# Altium schematic sheet IN14二灯.SchDoc
size A2; SheetNumber: 1; SheetTotal: 1
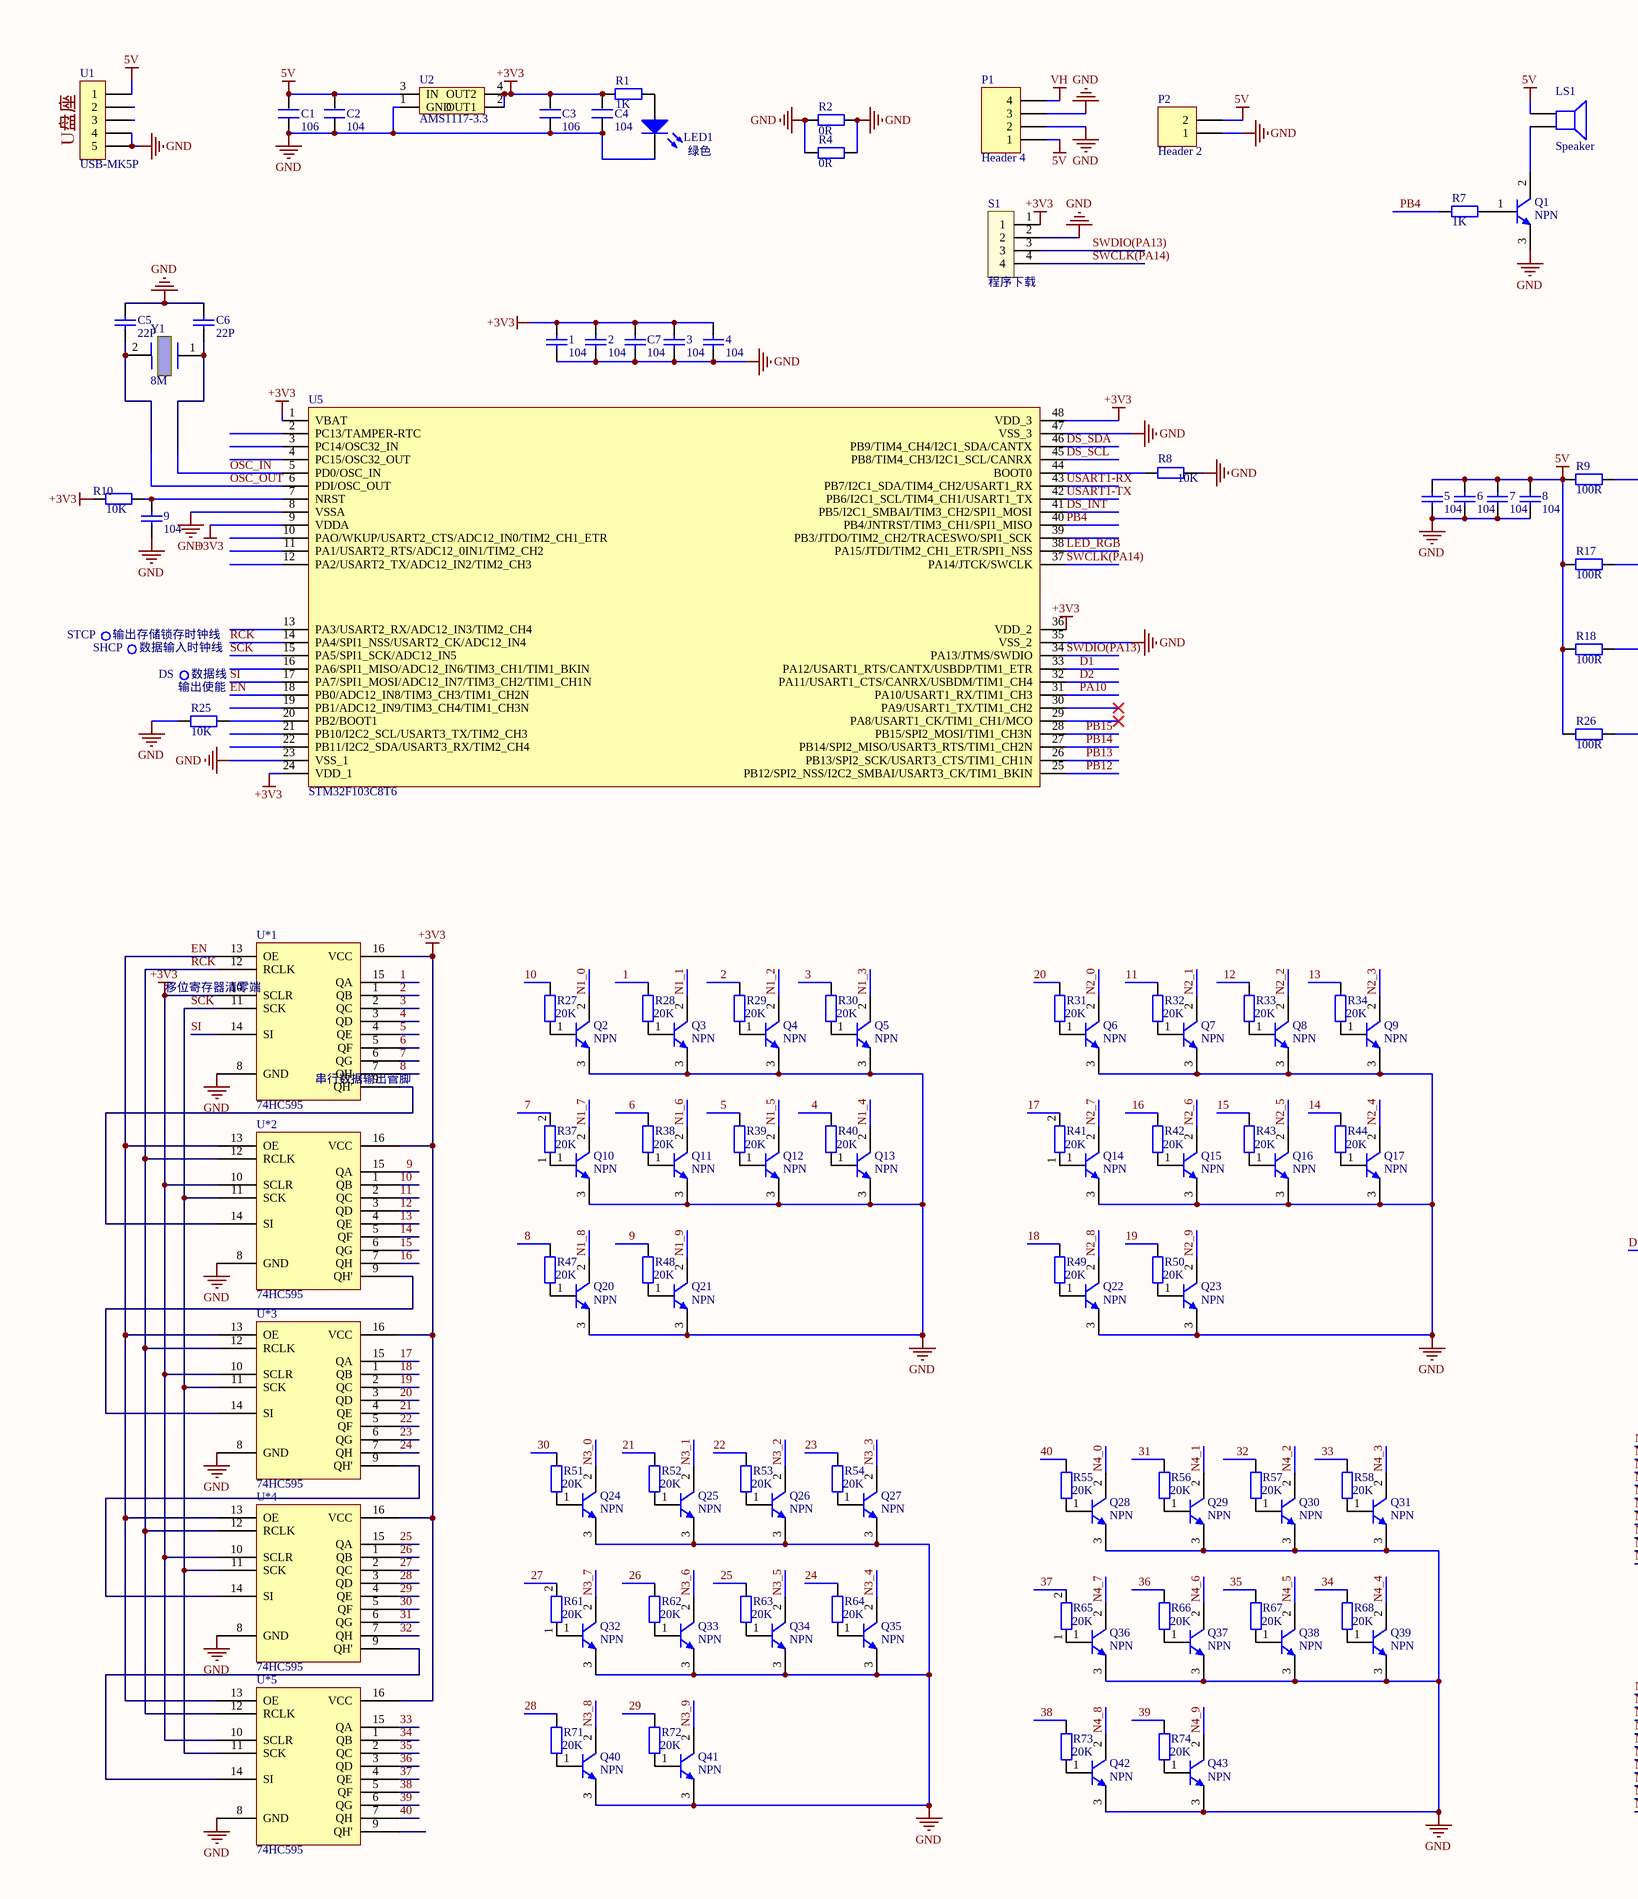
[diagram p0: IN14二灯.SchDoc, left]
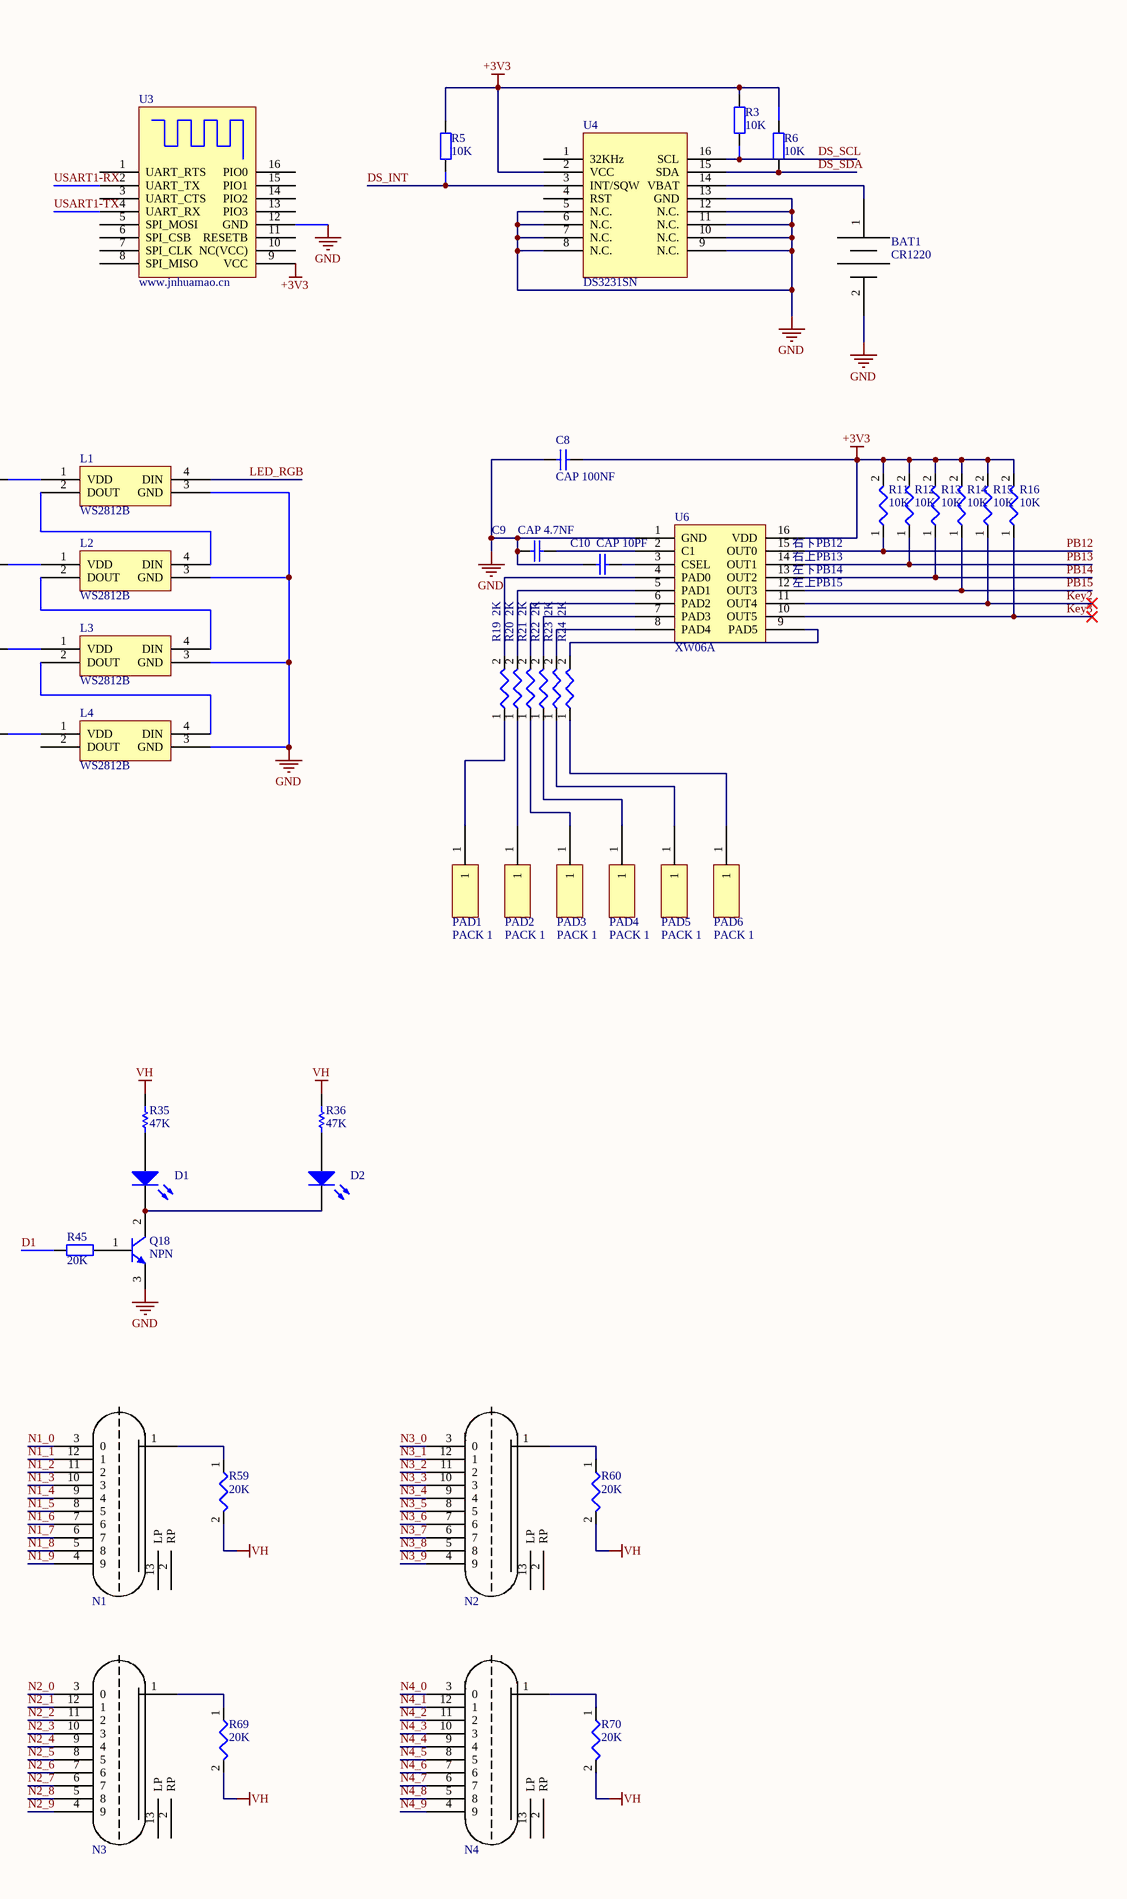
[diagram p1: IN14二灯.SchDoc, right]

## Parts
1  104  [0603C]
2  104  [0603C]
3  104  [0603C]
4  104  [0603C]
5  104  [0603C]
6  104  [0603C]
7  104  [0603C]
8  104  [0603C]
9  104  [0603C]
BAT1  CR1220  [1220]
C1  106  [0805C]
C2  104  [0603C]
C3  106  [0805C]
C4  104  [0603C]
C5  22P  [0603C]
C6  22P  [0603C]
C7  104  [0603C]
C8  CAP 100NF  [0603C]
C9  CAP 4.7NF  [0603C]
C10  CAP 10PF  [0603C]
D1  LED0  [R38]  (value not drawn)
D2  LED0  [R38]  (value not drawn)
L1  WS2812B  [WS2812B]
L2  WS2812B  [WS2812B]
L3  WS2812B  [WS2812B]
L4  WS2812B  [WS2812B]
LED1  绿色  [LED_0805]
LS1  Speaker  [蜂鸣器9*9*5]
N1  IN_14  [IN14]  (value not drawn)
N2  IN_14  [IN14]  (value not drawn)
N3  IN_14  [IN14]  (value not drawn)
N4  IN_14  [IN14]  (value not drawn)
P1  Header 4  [XH2.54 4p贴片]
P2  Header 2  [XH2.54-2P]
PAD1  PACK 1  [PACK 1]
PAD2  PACK 1  [PACK 1]
PAD3  PACK 1  [PACK 1]
PAD4  PACK 1  [PACK 1]
PAD5  PACK 1  [PACK 1]
PAD6  PACK 1  [PACK 1]
Q1  NPN  [LC-SOT-23(SOT-23-3)]
Q2  NPN  [LC-SOT-23(SOT-23-3)]
Q3  NPN  [LC-SOT-23(SOT-23-3)]
Q4  NPN  [LC-SOT-23(SOT-23-3)]
Q5  NPN  [LC-SOT-23(SOT-23-3)]
Q6  NPN  [LC-SOT-23(SOT-23-3)]
Q7  NPN  [LC-SOT-23(SOT-23-3)]
Q8  NPN  [LC-SOT-23(SOT-23-3)]
Q9  NPN  [LC-SOT-23(SOT-23-3)]
Q10  NPN  [LC-SOT-23(SOT-23-3)]
Q11  NPN  [LC-SOT-23(SOT-23-3)]
Q12  NPN  [LC-SOT-23(SOT-23-3)]
Q13  NPN  [LC-SOT-23(SOT-23-3)]
Q14  NPN  [LC-SOT-23(SOT-23-3)]
Q15  NPN  [LC-SOT-23(SOT-23-3)]
Q16  NPN  [LC-SOT-23(SOT-23-3)]
Q17  NPN  [LC-SOT-23(SOT-23-3)]
Q18  NPN  [LC-SOT-23(SOT-23-3)]
Q20  NPN  [LC-SOT-23(SOT-23-3)]
Q21  NPN  [LC-SOT-23(SOT-23-3)]
Q22  NPN  [LC-SOT-23(SOT-23-3)]
Q23  NPN  [LC-SOT-23(SOT-23-3)]
Q24  NPN  [LC-SOT-23(SOT-23-3)]
Q25  NPN  [LC-SOT-23(SOT-23-3)]
Q26  NPN  [LC-SOT-23(SOT-23-3)]
Q27  NPN  [LC-SOT-23(SOT-23-3)]
Q28  NPN  [LC-SOT-23(SOT-23-3)]
Q29  NPN  [LC-SOT-23(SOT-23-3)]
Q30  NPN  [LC-SOT-23(SOT-23-3)]
Q31  NPN  [LC-SOT-23(SOT-23-3)]
Q32  NPN  [LC-SOT-23(SOT-23-3)]
Q33  NPN  [LC-SOT-23(SOT-23-3)]
Q34  NPN  [LC-SOT-23(SOT-23-3)]
Q35  NPN  [LC-SOT-23(SOT-23-3)]
Q36  NPN  [LC-SOT-23(SOT-23-3)]
Q37  NPN  [LC-SOT-23(SOT-23-3)]
Q38  NPN  [LC-SOT-23(SOT-23-3)]
Q39  NPN  [LC-SOT-23(SOT-23-3)]
Q40  NPN  [LC-SOT-23(SOT-23-3)]
Q41  NPN  [LC-SOT-23(SOT-23-3)]
Q42  NPN  [LC-SOT-23(SOT-23-3)]
Q43  NPN  [LC-SOT-23(SOT-23-3)]
R1  1K  [0603R]
R2  0R  [0603R]
R3  10K  [0603R]
R4  0R  [0603R]
R5  10K  [0603R]
R6  10K  [0603R]
R7  1K  [0603R]
R8  10K  [0603R]
R9  100R  [0603R]
R10  10K  [0603R]
R11  10K  [0603R]
R12  10K  [0603R]
R13  10K  [0603R]
R14  10K  [0603R]
R15  10K  [0603R]
R16  10K  [0603R]
R17  100R  [0603R]
R18  100R  [0603R]
R19  2K  [0603R]
R20  2K  [0603R]
R21  2K  [0603R]
R22  2K  [0603R]
R23  2K  [0603R]
R24  2K  [0603R]
R25  10K  [0603R]
R26  100R  [0603R]
R27  20K  [0603R]
R28  20K  [0603R]
R29  20K  [0603R]
R30  20K  [0603R]
R31  20K  [0603R]
R32  20K  [0603R]
R33  20K  [0603R]
R34  20K  [0603R]
R35  value 47K  [0805C]  (hidden comment: Res1)
R36  value 47K  [0805C]  (hidden comment: Res1)
R37  20K  [0603R]
R38  20K  [0603R]
R39  20K  [0603R]
R40  20K  [0603R]
R41  20K  [0603R]
R42  20K  [0603R]
R43  20K  [0603R]
R44  20K  [0603R]
R45  20K  [0603R]
R47  20K  [0603R]
R48  20K  [0603R]
R49  20K  [0603R]
R50  20K  [0603R]
R51  20K  [0603R]
R52  20K  [0603R]
R53  20K  [0603R]
R54  20K  [0603R]
R55  20K  [0603R]
R56  20K  [0603R]
R57  20K  [0603R]
R58  20K  [0603R]
R59  20K  [0805C]
R60  20K  [0805C]
R61  20K  [0603R]
R62  20K  [0603R]
R63  20K  [0603R]
R64  20K  [0603R]
R65  20K  [0603R]
R66  20K  [0603R]
R67  20K  [0603R]
R68  20K  [0603R]
R69  20K  [0805C]
R70  20K  [0805C]
R71  20K  [0603R]
R72  20K  [0603R]
R73  20K  [0603R]
R74  20K  [0603R]
S1  程序下载  [HDR1X4]
U1  USB-MK5P  [USB-MK5P]
U2  AMS1117-3.3  [LC-SOT-223 (1117)]
U3  www.jnhuamao.cn  [HM-05_06_07_11]
U4  DS3231SN  [LC-SOP-16_300mil]
U5  STM32F103C8T6  [LQFP-48_M]
U6  XW06A  [SO-16_L]
U*1  74HC595  [SOP16_M]
U*2  74HC595  [SOP16_M]
U*3  74HC595  [SOP16_M]
U*4  74HC595  [SOP16_M]
U*5  74HC595  [SOP16_M]
Y1  8M  [Y-XTAL T]

## Nets
5V: 5.2 6.2 7.2 8.2 C1.2 C2.2 LS1.1 P1.1 P2.2 R9.1 R17.1 R18.1 R26.1 U1.1 U2.3(IN)
+3V3: 1.2 2.2 3.2 4.2 C3.2 C4.2 C7.1 C8.2 R1.1 R3.2 R5.2 R6.2 R10.2 R11.2 R12.2 R13.2 R14.2 R15.2 R16.2 S1.1 U2.2(OUT1) U2.4(OUT2) U3.9(VCC) U4.2(VCC) U5.1(VBAT) U5.9(VDDA) U5.24(VDD_1) U5.36(VDD_2) U5.48(VDD_3) U6.16(VDD) U*1.10(SCLR) U*1.16(VCC) U*2.10(SCLR) U*2.16(VCC) U*3.10(SCLR) U*3.16(VCC) U*4.10(SCLR) U*4.16(VCC) U*5.10(SCLR) U*5.16(VCC)
GND: 1.1 2.1 3.1 4.1 5.1 6.1 7.1 8.1 9.2 BAT1.2 C1.1 C2.1 C3.1 C4.1 C5.2 C6.2 C7.2 C8.1 C9.1 C10.1 L1.3(GND) L2.3(GND) L3.3(GND) L4.3(GND) LED1.2(K) P1.2 P1.3 P2.1 Q1.3(C) Q2.3(C) Q3.3(C) Q4.3(C) Q5.3(C) Q6.3(C) Q7.3(C) Q8.3(C) Q9.3(C) Q10.3(C) Q11.3(C) Q12.3(C) Q13.3(C) Q14.3(C) Q15.3(C) Q16.3(C) Q17.3(C) Q18.3(C) Q20.3(C) Q21.3(C) Q22.3(C) Q23.3(C) Q24.3(C) Q25.3(C) Q26.3(C) Q27.3(C) Q28.3(C) Q29.3(C) Q30.3(C) Q31.3(C) Q32.3(C) Q33.3(C) Q34.3(C) Q35.3(C) Q36.3(C) Q37.3(C) Q38.3(C) Q39.3(C) Q40.3(C) Q41.3(C) Q42.3(C) Q43.3(C) R2.1 R2.2 R4.1 R4.2 R8.1 R25.2 S1.2 U1.4 U1.5 U2.1(GND) U3.12(GND) U4.5(N.C.) U4.6(N.C.) U4.7(N.C.) U4.8(N.C.) U4.9(N.C.) U4.10(N.C.) U4.11(N.C.) U4.12(N.C.) U4.13(GND) U5.8(VSSA) U5.23(VSS_1) U5.35(VSS_2) U5.47(VSS_3) U6.1(GND) U*1.8(GND) U*2.8(GND) U*3.8(GND) U*4.8(GND) U*5.8(GND)
VH: P1.4 R35.1 R36.1 R59.2 R60.2 R69.2 R70.2
1: R28.2 U*1.15(QA)
2: R29.2 U*1.1(QB)
3: R30.2 U*1.2(QC)
4: R40.2 U*1.3(QD)
5: R39.2 U*1.4(QE)
6: R38.2 U*1.5(QF)
7: R37.2 U*1.6(QG)
8: R47.2 U*1.7(QH)
9: R48.2 U*2.15(QA)
10: R27.2 U*2.1(QB)
11: R32.2 U*2.2(QC)
12: R33.2 U*2.3(QD)
13: R34.2 U*2.4(QE)
14: R44.2 U*2.5(QF)
15: R43.2 U*2.6(QG)
16: R42.2 U*2.7(QH)
17: R41.2 U*3.15(QA)
18: R49.2 U*3.1(QB)
19: R50.2 U*3.2(QC)
20: R31.2 U*3.3(QD)
21: R52.2 U*3.4(QE)
22: R53.2 U*3.5(QF)
23: R54.2 U*3.6(QG)
24: R64.2 U*3.7(QH)
25: R63.2 U*4.15(QA)
26: R62.2 U*4.1(QB)
27: R61.2 U*4.2(QC)
28: R71.2 U*4.3(QD)
29: R72.2 U*4.4(QE)
30: R51.2 U*4.5(QF)
31: R56.2 U*4.6(QG)
32: R57.2 U*4.7(QH)
33: R58.2 U*5.15(QA)
34: R68.2 U*5.1(QB)
35: R67.2 U*5.2(QC)
36: R66.2 U*5.3(QD)
37: R65.2 U*5.4(QE)
38: R73.2 U*5.5(QF)
39: R74.2 U*5.6(QG)
40: R55.2 U*5.7(QH)
D1: R45.1 U5.33(PA12/USART1_RTS/CANTX/USBDP/TIM1_ETR)
D2: U5.32(PA11/USART1_CTS/CANRX/USBDM/TIM1_CH4)
DS_INT: R5.1 U4.3(INT/SQW) U5.41(PB5/I2C1_SMBAI/TIM3_CH2/SPI1_MOSI)
DS_SCL: R3.1 U4.16(SCL) U5.45(PB8/TIM4_CH3/I2C1_SCL/CANRX)
DS_SDA: R6.1 U4.15(SDA) U5.46(PB9/TIM4_CH4/I2C1_SDA/CANTX)
EN: U5.18(PB0/ADC12_IN8/TIM3_CH3/TIM1_CH2N) U*1.13(OE) U*2.13(OE) U*3.13(OE) U*4.13(OE) U*5.13(OE)
Key2: R15.1 U6.11(OUT4)
Key3: R16.1 U6.10(OUT5)
LED_RGB: L1.4(DIN) U5.38(PA15/JTDI/TIM2_CH1_ETR/SPI1_NSS)
N1_0: N1.3(0) Q2.2(B)
N1_1: N1.12(1) Q3.2(B)
N1_2: N1.11(2) Q4.2(B)
N1_3: N1.10(3) Q5.2(B)
N1_4: N1.9(4) Q13.2(B)
N1_5: N1.8(5) Q12.2(B)
N1_6: N1.7(6) Q11.2(B)
N1_7: N1.6(7) Q10.2(B)
N1_8: N1.5(8) Q20.2(B)
N1_9: N1.4(9) Q21.2(B)
N2_0: N3.3(0) Q6.2(B)
N2_1: N3.12(1) Q7.2(B)
N2_2: N3.11(2) Q8.2(B)
N2_3: N3.10(3) Q9.2(B)
N2_4: N3.9(4) Q17.2(B)
N2_5: N3.8(5) Q16.2(B)
N2_6: N3.7(6) Q15.2(B)
N2_7: N3.6(7) Q14.2(B)
N2_8: N3.5(8) Q22.2(B)
N2_9: N3.4(9) Q23.2(B)
N3_0: N2.3(0) Q24.2(B)
N3_1: N2.12(1) Q25.2(B)
N3_2: N2.11(2) Q26.2(B)
N3_3: N2.10(3) Q27.2(B)
N3_4: N2.9(4) Q35.2(B)
N3_5: N2.8(5) Q34.2(B)
N3_6: N2.7(6) Q33.2(B)
N3_7: N2.6(7) Q32.2(B)
N3_8: N2.5(8) Q40.2(B)
N3_9: N2.4(9) Q41.2(B)
N4_0: N4.3(0) Q28.2(B)
N4_1: N4.12(1) Q29.2(B)
N4_2: N4.11(2) Q30.2(B)
N4_3: N4.10(3) Q31.2(B)
N4_4: N4.9(4) Q39.2(B)
N4_5: N4.8(5) Q38.2(B)
N4_6: N4.7(6) Q37.2(B)
N4_7: N4.6(7) Q36.2(B)
N4_8: N4.5(8) Q42.2(B)
N4_9: N4.4(9) Q43.2(B)
OSC_IN: C6.1 U5.5(PD0/OSC_IN) Y1.1
OSC_OUT: C5.1 U5.6(PDI/OSC_OUT) Y1.2
PA10: U5.31(PA10/USART1_RX/TIM1_CH3)
PB4: R7.2 U5.40(PB4/JNTRST/TIM3_CH1/SPI1_MISO)
PB12: R11.1 U5.25(PB12/SPI2_NSS/I2C2_SMBAI/USART3_CK/TIM1_BKIN) U6.15(OUT0)
PB13: R12.1 U5.26(PB13/SPI2_SCK/USART3_CTS/TIM1_CH1N) U6.14(OUT1)
PB14: R13.1 U5.27(PB14/SPI2_MISO/USART3_RTS/TIM1_CH2N) U6.13(OUT2)
PB15: R14.1 U5.28(PB15/SPI2_MOSI/TIM1_CH3N) U6.12(OUT3)
RCK: U5.14(PA4/SPI1_NSS/USART2_CK/ADC12_IN4) U*1.12(RCLK) U*2.12(RCLK) U*3.12(RCLK) U*4.12(RCLK) U*5.12(RCLK)
SCK: U5.15(PA5/SPI1_SCK/ADC12_IN5) U*1.11(SCK) U*2.11(SCK) U*3.11(SCK) U*4.11(SCK) U*5.11(SCK)
SI: U5.17(PA7/SPI1_MOSI/ADC12_IN7/TIM3_CH2/TIM1_CH1N) U*1.14(SI)
SWCLK(PA14): S1.4 U5.37(PA14/JTCK/SWCLK)
SWDIO(PA13): S1.3 U5.34(PA13/JTMS/SWDIO)
USART1-RX: U3.2(UART_TX) U5.43(PB7/I2C1_SDA/TIM4_CH2/USART1_RX)
USART1-TX: U3.4(UART_RX) U5.42(PB6/I2C1_SCL/TIM4_CH1/USART1_TX)
Net9_1: 9.1 R10.1 U5.7(NRST)
NetBAT1_1: BAT1.1 U4.14(VBAT)
NetC9_2: C9.2 U6.2(C1)
NetC10_2: C10.2 U6.3(CSEL)
NetD1_1: D1.1(A) R35.2
NetD1_2: D1.2(K) D2.2(K) Q18.2(B)
NetD2_1: D2.1(A) R36.2
NetL1_1: L1.1(VDD) R9.2
NetL1_2: L1.2(DOUT) L2.4(DIN)
NetL2_1: L2.1(VDD) R17.2
NetL2_2: L2.2(DOUT) L3.4(DIN)
NetL3_1: L3.1(VDD) R18.2
NetL3_2: L3.2(DOUT) L4.4(DIN)
NetL4_1: L4.1(VDD) R26.2
NetLED1_1: LED1.1(A) R1.2
NetLS1_2: LS1.2 Q1.2(B)
NetN1_1: N1.1(VCC) R59.1
NetN2_1: N2.1(VCC) R60.1
NetN3_1: N3.1(VCC) R69.1
NetN4_1: N4.1(VCC) R70.1
NetPAD1_1: PAD1.1 R19.1
NetPAD2_1: PAD2.1 R20.1
NetPAD3_1: PAD3.1 R21.1
NetPAD4_1: PAD4.1 R22.1
NetPAD5_1: PAD5.1 R23.1
NetPAD6_1: PAD6.1 R24.1
NetQ1_1: Q1.1(E) R7.1
NetQ2_1: Q2.1(E) R27.1
NetQ3_1: Q3.1(E) R28.1
NetQ4_1: Q4.1(E) R29.1
NetQ5_1: Q5.1(E) R30.1
NetQ6_1: Q6.1(E) R31.1
NetQ7_1: Q7.1(E) R32.1
NetQ8_1: Q8.1(E) R33.1
NetQ9_1: Q9.1(E) R34.1
NetQ10_1: Q10.1(E) R37.1
NetQ11_1: Q11.1(E) R38.1
NetQ12_1: Q12.1(E) R39.1
NetQ13_1: Q13.1(E) R40.1
NetQ14_1: Q14.1(E) R41.1
NetQ15_1: Q15.1(E) R42.1
NetQ16_1: Q16.1(E) R43.1
NetQ17_1: Q17.1(E) R44.1
NetQ18_1: Q18.1(E) R45.2
NetQ20_1: Q20.1(E) R47.1
NetQ21_1: Q21.1(E) R48.1
NetQ22_1: Q22.1(E) R49.1
NetQ23_1: Q23.1(E) R50.1
NetQ24_1: Q24.1(E) R51.1
NetQ25_1: Q25.1(E) R52.1
NetQ26_1: Q26.1(E) R53.1
NetQ27_1: Q27.1(E) R54.1
NetQ28_1: Q28.1(E) R55.1
NetQ29_1: Q29.1(E) R56.1
NetQ30_1: Q30.1(E) R57.1
NetQ31_1: Q31.1(E) R58.1
NetQ32_1: Q32.1(E) R61.1
NetQ33_1: Q33.1(E) R62.1
NetQ34_1: Q34.1(E) R63.1
NetQ35_1: Q35.1(E) R64.1
NetQ36_1: Q36.1(E) R65.1
NetQ37_1: Q37.1(E) R66.1
NetQ38_1: Q38.1(E) R67.1
NetQ39_1: Q39.1(E) R68.1
NetQ40_1: Q40.1(E) R71.1
NetQ41_1: Q41.1(E) R72.1
NetQ42_1: Q42.1(E) R73.1
NetQ43_1: Q43.1(E) R74.1
NetR8_2: R8.2 U5.44(BOOT0)
NetR19_2: R19.2 U6.4(PAD0)
NetR20_2: R20.2 U6.5(PAD1)
NetR21_2: R21.2 U6.6(PAD2)
NetR22_2: R22.2 U6.7(PAD3)
NetR23_2: R23.2 U6.8(PAD4)
NetR24_2: R24.2 U6.9(PAD5)
NetR25_1: R25.1 U5.20(PB2/BOOT1)
NetU*1_9: U*1.9(QH') U*2.14(SI)
NetU*2_9: U*2.9(QH') U*3.14(SI)
NetU*3_9: U*3.9(QH') U*4.14(SI)
NetU*4_9: U*4.9(QH') U*5.14(SI)

Not connected (* = marked no-connect by the designer): L4 2(DOUT); N1 2(RP) 13(LP); N2 2(RP) 13(LP); N3 2(RP) 13(LP); N4 2(RP) 13(LP); U1 2 3; U3 1(UART_RTS) 3(UART_CTS) 5(SPI_MOSI) 6(SPI_CSB) 7(SPI_CLK) 8(SPI_MISO) 10(NC(VCC)) 11(RESETB) 13(PIO3) 14(PIO2) 15(PIO1) 16(PIO0); U4 1(32KHz) 4(RST); U5 2(PC13/TAMPER-RTC) 3(PC14/OSC32_IN) 4(PC15/OSC32_OUT) 10(PAO/WKUP/USART2_CTS/ADC12_IN0/TIM2_CH1_ETR) 11(PA1/USART2_RTS/ADC12_0IN1/TIM2_CH2) 12(PA2/USART2_TX/ADC12_IN2/TIM2_CH3) 13(PA3/USART2_RX/ADC12_IN3/TIM2_CH4) 16(PA6/SPI1_MISO/ADC12_IN6/TIM3_CH1/TIM1_BKIN) 19(PB1/ADC12_IN9/TIM3_CH4/TIM1_CH3N) 21(PB10/I2C2_SCL/USART3_TX/TIM2_CH3) 22(PB11/I2C2_SDA/USART3_RX/TIM2_CH4) 29(PA8/USART1_CK/TIM1_CH1/MCO)* 30(PA9/USART1_TX/TIM1_CH2)* 39(PB3/JTDO/TIM2_CH2/TRACESWO/SPI1_SCK); U*5 9(QH')

## Notes on the sheet
- (near U1) U盘座
- (near U6) 右上PB13
- (near U6) 右下PB12
- (near U6) 左下PB14
- (near U6) 左上PB15
- STCP
- SHCP
- 输出存储锁存时钟线
- 数据输入时钟线
- (near R25) DS
- (near R25) 输出使能
- (near R25) 数据线
- (near U*1) 移位寄存器清零端
- (near U*1) 串行数据输出管脚

## Library data of the parts
1-9 C5-C7 = Cap: 无极性电容; Value: 100nF; Published: 8-Jun-2000; LatestRevisionDate: 17-Jul-2002; LatestRevisionNote: Re-released for DXP Platform.; PackageReference: RAD-0.3; Publisher: Altium Limited
C1-C4 = C
C8-C10 = CAP ?F
D1 D2 = LED0: Typical INFRARED GaAs LED; Published: 8-Jun-2000; LatestRevisionDate: 08-Jul-2005; LatestRevisionNote: Mech Layer 1 removed.; PackageReference: LED-0; Publisher: Altium Limited; PackageDescription: LED; 2 Leads
LED1 = LED0: 发光二极管; Published: 8-Jun-2000; LatestRevisionDate: 08-Jul-2005; LatestRevisionNote: Mech Layer 1 removed.; PackageReference: LED-0; Publisher: Altium Limited
LS1 = Speaker: Loudspeaker; Published: 24-Mar-1999; LatestRevisionDate: 17-Jul-2002; LatestRevisionNote: Re-released for DXP Platform.; PackageReference: PIN2; Publisher: Altium Limited
P1 = Header 4: Header, 4-Pin; LatestRevisionDate: 17-Jul-2002; LatestRevisionNote: Re-released for DXP Platform.; Publisher: Altium Limited
P2 = Header 2: Header, 2-Pin; LatestRevisionDate: 17-Jul-2002; LatestRevisionNote: Re-released for DXP Platform.; Publisher: Altium Limited
Q1-Q18 Q20-Q43 = NPN: NPN Bipolar Transistor; Published: 8-Jun-2000; LatestRevisionDate: 17-Jul-2002; LatestRevisionNote: Re-released for DXP Platform.; PackageReference: TO-226-AA; Publisher: Altium Limited; PackageDescription: TO, Flat Index; 3 In-Line, Axial Leads; Body Dia. 4.8mm; Leads 0.55 x 0.51 mm (max); Code_JEDEC: TO-226-AA
R1 R7 = Res1: 贴片电阻; Published: 8-Jun-2000; LatestRevisionDate: 17-Jul-2002; LatestRevisionNote: Re-released for DXP Platform.; PackageReference: AXIAL-0.4; Publisher: Altium Limited; Value: 1K
R2-R6 R8-R10 R17 R18 R25-R34 R37-R45 R47-R58 R61-R68 R71-R74 = Res1: 贴片电阻; Value: 1K; Published: 8-Jun-2000; LatestRevisionDate: 17-Jul-2002; LatestRevisionNote: Re-released for DXP Platform.; PackageReference: AXIAL-0.4; Publisher: Altium Limited
R11-R16 R19-R24 R59 R60 R69 R70 = ?K
R35 R36 = Res1: Resistor; Published: 8-Jun-2000; LatestRevisionDate: 17-Jul-2002; LatestRevisionNote: Re-released for DXP Platform.; PackageReference: AXIAL-0.3; Publisher: Altium Limited; PackageDescription: Axial Device, Thru-Hole; 2 Leads; 0.3 in Pin Spacing
S1 = S-4
U1 = CON5: Connector
U2 = AMS1117
U3 = HM_05_06_07_11: HM bluetooth module HM-05,HM-06,HM-07, HM-11
U*1-U*5 = Component_1
Y1 = JZ